# Altium schematic sheet l1.schdoc
size 282 x 162 mm
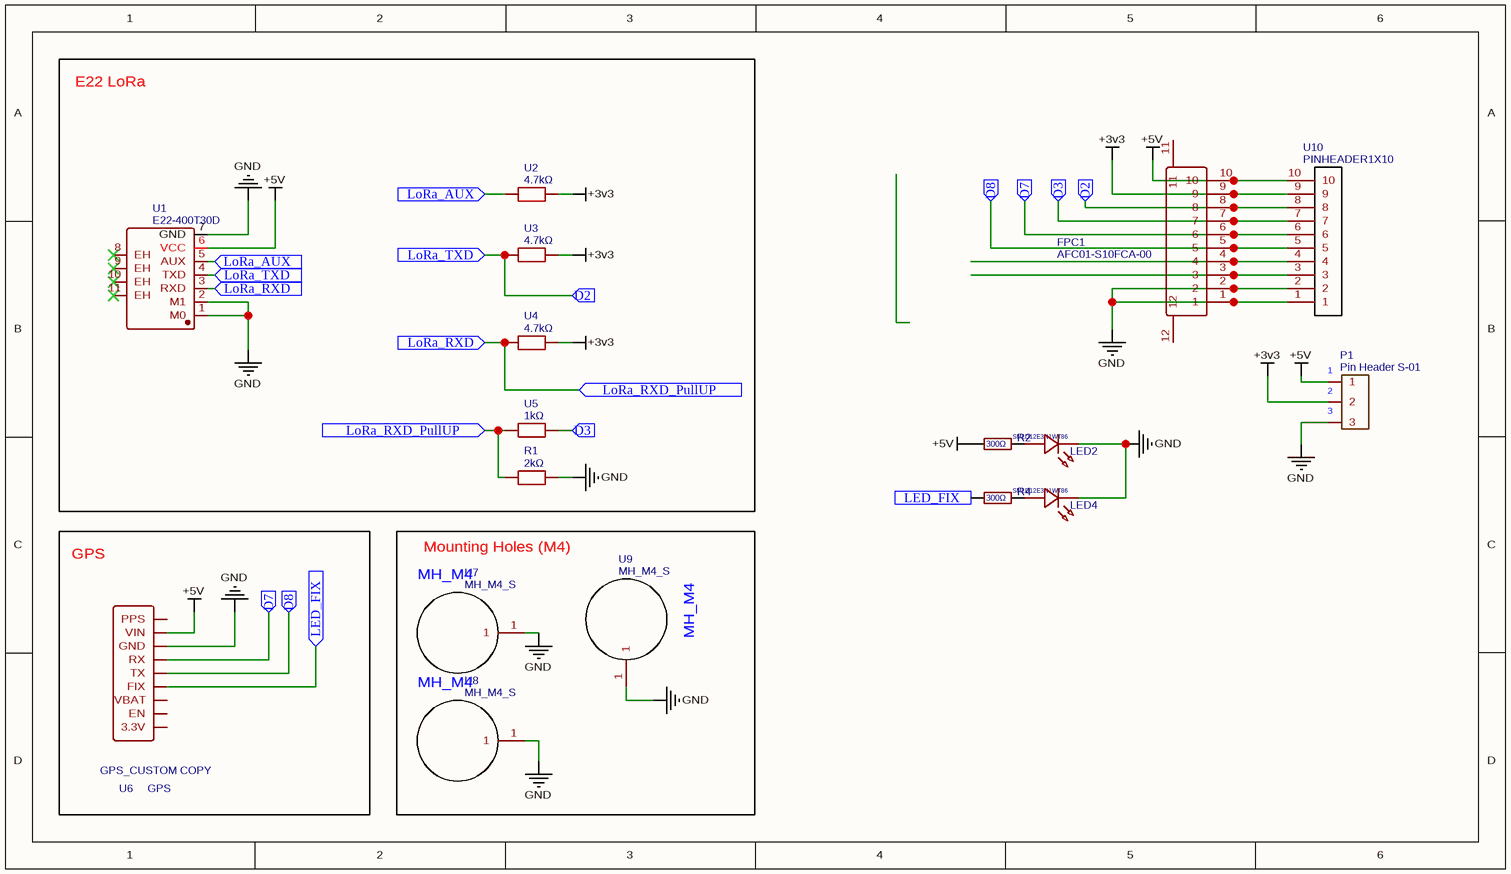
[diagram p0: l1.schdoc]

## Parts
FPC1  AFC01-S10FCA-00  [FPC-SMD_P0.5-10P_FGS-XJ-H2.0]
LED2  SMLD12E3N1WT86  [LED0603-RD_GREEN]
LED4  SMLD12E3N1WT86  [LED0603-RD_GREEN]
P1  Pin Header S-01  [CONNECTOR_PINHEADER_2.54MM:PINHEADER_1X3]
R1  2kΩ  [R0603]
R2  300Ω  [R1206]
R4  300Ω  [R1206]
U1  E22-400T30D  [COMM-TH_E22-400T30D]
U2  4.7kΩ  [R1206]
U3  4.7kΩ  [R1206]
U4  4.7kΩ  [R1206]
U5  1kΩ  [R0402]
U6  GPS_CUSTOM COPY  [ADAFRUIT GPS]
U7  MH_M4_S  [MH_M4_PCB]
U8  MH_M4_S  [MH_M4_PCB]
U9  MH_M4_S  [MH_M4_PCB]
U10  PINHEADER1X10  [PINHEADER1X10]

## Blocks framed on the sheet
E22 LoRa: R1 U1-U5
GPS: U6
Mounting Holes (M4): U7-U9

## Ports
D2 (in), D3 (in), D7 (in), D8 (in), LED_FIX (in), LoRa_AUX (in), LoRa_RXD (in), LoRa_RXD_PullUP (in), LoRa_TXD (in)

## Nets
+3v3: FPC1.9 P1.2 U2.2 U3.2 U4.2 U10.9
+5V: FPC1.10 P1.1 R2.1 U1.6(VCC) U6.8(VIN) U10.10
GND: FPC1.1 FPC1.2 LED2.1(-) LED4.1(-) P1.3 R1.2 U1.1(M0) U1.2(M1) U1.7(GND) U6.7(GND) U7.1 U8.1 U9.1 U10.1 U10.2
D2: FPC1.8 U1.4(TXD) U3.1 U10.8 ; port LoRa_TXD, port D2
D3: FPC1.7 U5.2 U10.7 ; port D3
D7: FPC1.6 U6.6(RX) U10.6 ; port D7
D8: FPC1.5 U6.5(TX) U10.5 ; port D8
LED_FIX: R4.1 U6.4(FIX) ; port LED_FIX
LoRa_AUX: U1.5(AUX) U2.1 ; port LoRa_AUX
LoRa_RXD: R1.1 U1.3(RXD) U4.1 U5.1 ; port LoRa_RXD, port LoRa_RXD_PullUP
NetFPC1_3: FPC1.3 U10.3
NetFPC1_4: FPC1.4 U10.4
NetLED2_2: LED2.2(+) R2.2
NetLED4_2: LED4.2(+) R4.2

Not connected (* = marked no-connect by the designer): FPC1 11 12; U1 8(EH)* 9(EH)* 10(EH)* 11(EH)*; U6 1(3.3V) 2(EN) 3(VBAT) 9(PPS)

## Notes on the sheet
- (in symbol GPS_CUSTOM COPY) GPS
- (in symbol MH_M4_S) MH_M4

## Library data of the parts
FPC1 = AFC01-S10FCA-00: Manufacturer: JS(钜硕电子); Contributor: LCSC; Supplier: LCSC; Supplier Part: C262659; Manufacturer Part: AFC01-S10FCA-00; JLCPCB Part Class: Extended Part; spicePre: F; spiceSymbolName: AFC01-S10FCA-00
LED2 LED4 = SMLD12E3N1WT86: Manufacturer: ROHM(罗姆); Contributor: lcsc; Supplier: LCSC; Supplier Part: C2846641; Manufacturer Part: SMLD12E3N1WT86; JLCPCB Part Class: Extended Part; spicePre: L; spiceSymbolName: SMLD12E3N1WT86
P1 = Pin Header S-01: Manufacturer: BOOMELE; Manufacturer Part: Female headerHDR1X8-2.54; Contributor: blackhassio; Package Display: No; Supplier: LCSC; Supplier Part: C27438; JLCPCB Part Class: Extended Part; spicePre: P; spiceSymbolName: HEADER PAD 3X RMM COPY
R1 = 2kΩ: Manufacturer: VO(翔胜); Manufacturer Part: SCR0603F2K; Contributor: lcsc; nameAlias: Value; Supplier: LCSC; Supplier Part: C3016472; JLCPCB Part Class: Extended Part; spicePre: R; spiceSymbolName: SCR0603F2K
R2 R4 = 300Ω: Manufacturer: UNI-ROYAL(厚声); Manufacturer Part: 1206W4J0301T5E; nameAlias: Value; Supplier: LCSC; Supplier Part: C25372; JLCPCB Part Class: Extended Part; spicePre: R; spiceSymbolName: 1206W4J0301T5E
U1 = E22-400T30D: Manufacturer: EBYTE(亿佰特); Contributor: lcsc; Supplier: LCSC; Supplier Part: C518906; Manufacturer Part: E22-400T30D; JLCPCB Part Class: Extended Part; spicePre: U; spiceSymbolName: E22-400T30D
U2-U4 = 4.7kΩ: Manufacturer: FOJAN(富捷); Manufacturer Part: FRC1206J472 TS; nameAlias: Value; Contributor: lcsc; Supplier: LCSC; Supplier Part: C2907499; JLCPCB Part Class: Extended Part; spicePre: U; spiceSymbolName: FRC1206J472 TS
U5 = 1kΩ: Manufacturer: FH(风华); Manufacturer Part: TC02G1001FT; Contributor: lcsc; nameAlias: Value; Supplier: LCSC; Supplier Part: C2961360; JLCPCB Part Class: Extended Part; spicePre: U; spiceSymbolName: TC02G1001FT
U6 = GPS_CUSTOM COPY: Contributor: swnotjoao; spicePre: U; spiceSymbolName: GPS_CUSTOM COPY
U7-U9 = MH_M4_S: Contributor: js314dev; spicePre: U; spiceSymbolName: MH_M4_S
U10 = PINHEADER1X10: Contributor: sorza102; Supplier Part: undefined; spicePre: U; spiceSymbolName: PINHEADER1X10